# Altium schematic sheet Lipo_LiFePO4 Charger_2022-02-16.schdoc
size 795 x 256 mm
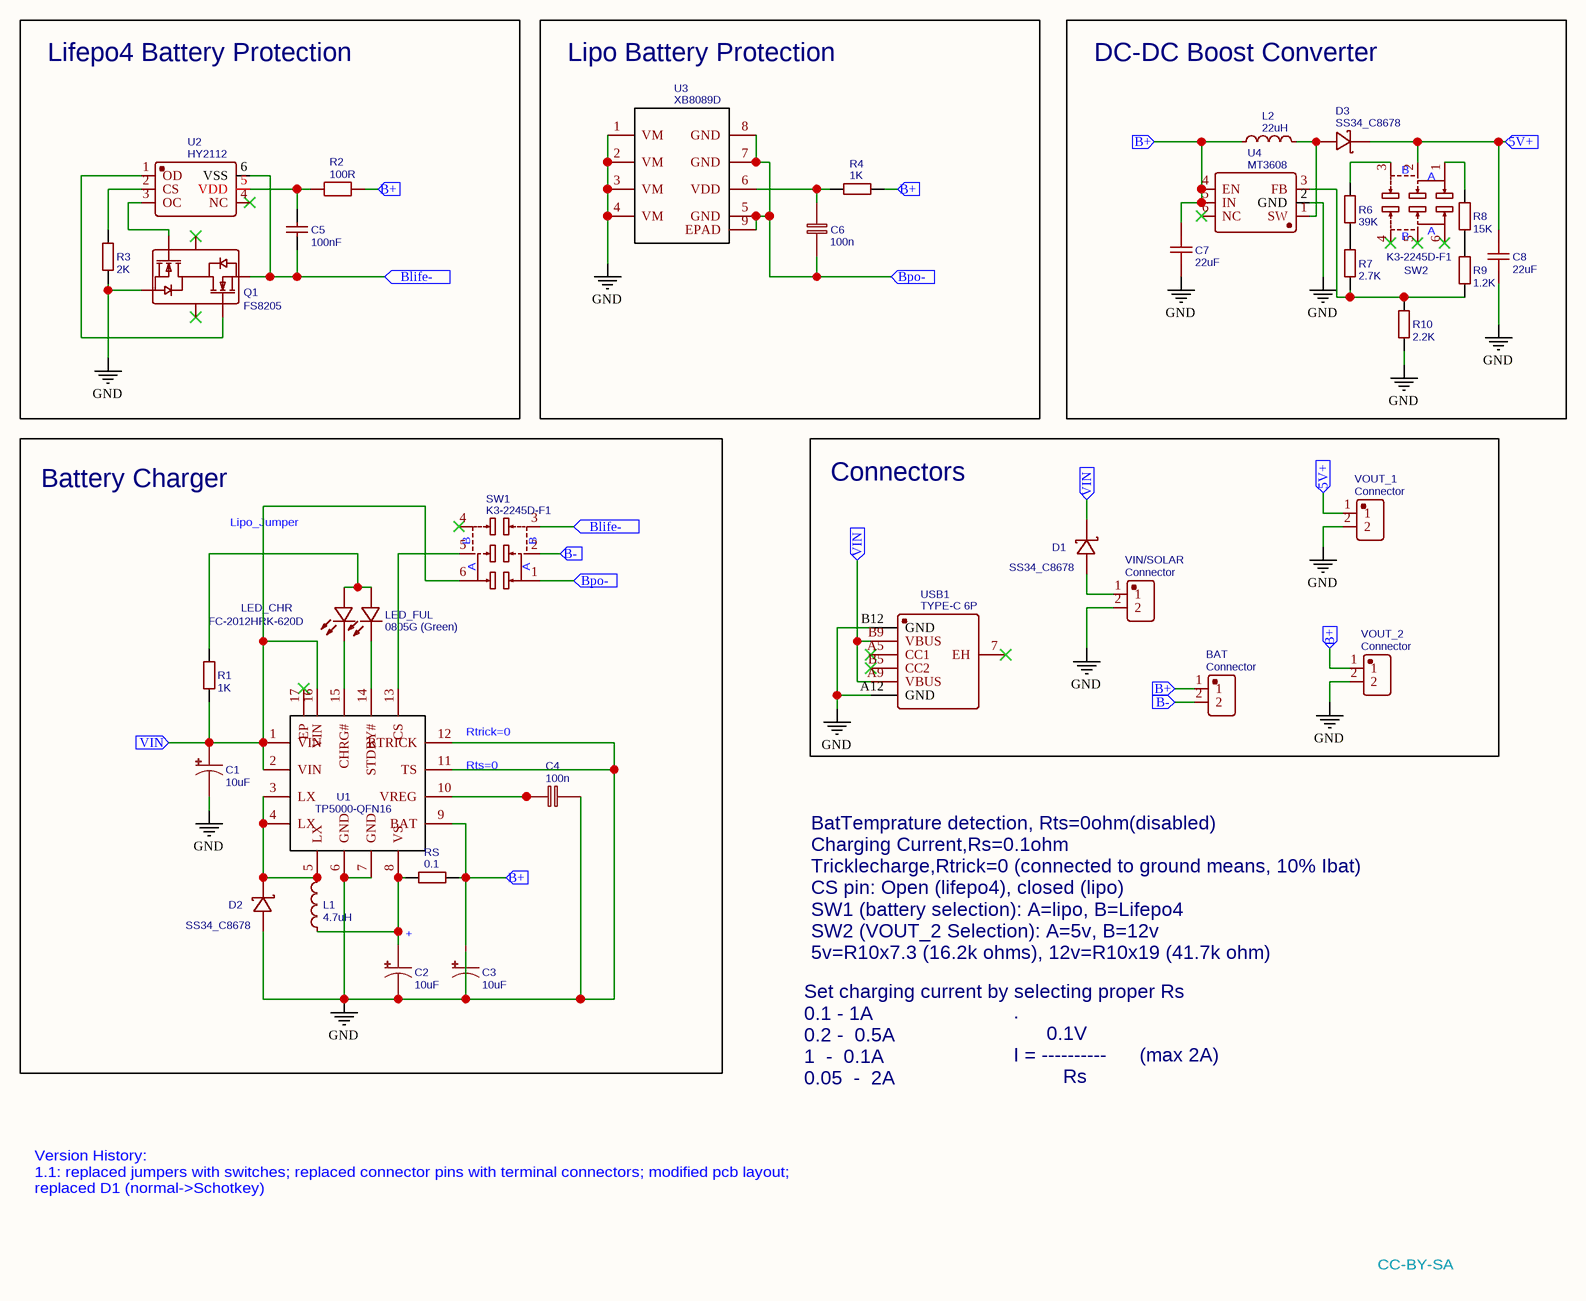
[diagram p0: Lipo_LiFePO4 Charger_2022-02-16.schdoc]

## Parts
BAT  Connector  [CONN-TH_XY308-2.54-2P]
C1  10uF  [CAP-SMD_L3.5-W2.8-R-RD]
C2  10uF  [CAP-SMD_L3.5-W2.8-R-RD]
C3  10uF  [CAP-SMD_L3.5-W2.8-R-RD]
C4  100n  [0805]
C5  100nF  [C0805]
C6  100n  [0805]
C7  22uF  [C0805]
C8  22uF  [C0805]
D1  SS34_C8678  [DO-214AC_L4.3-W2.7-LS5.3-RD]
D2  SS34_C8678  [DO-214AC_L4.3-W2.7-LS5.3-RD]
D3  SS34_C8678  [DO-214AC_L4.3-W2.7-LS5.3-RD]
L1  4.7uH  [IND-SMD_L7.1-W6.6]
L2  22uH  [IND-SMD_L7.0-W6.8]
LED_CHR  FC-2012HRK-620D  [LED0805-RD]
LED_FUL  0805G (Green)  [LED0805-RD]
Q1  FS8205  [SOT-23-6]
R1  1K  [R0805]
R2  100R  [0805]
R3  2K  [R0805]
R4  1K  [R0805]
R6  39K  [R0805]
R7  2.7K  [R0805]
R8  15K  [R0805]
R9  1.2K  [R0805]
R10  2.2K  [R0805]
RS  0.1  [R1206]
SW1  K3-2245D-F1  [SW-TH_K3-2245D-F1]
SW2  K3-2245D-F1  [SW-TH_K3-2245D-F1]
U1  TP5000-QFN16  [QFN-16_L4.0-W4.0-P0.65-BL-EP2.2]
U2  HY2112  [SOT-23-6]
U3  XB8089D  [SOIC-8_L5.0-W4.0-P1.27-LS6.0-BL-EP]
U4  MT3608  [SOT-23-6_L2.9-W1.6-P0.95-LS2.8-BR]
USB1  TYPE-C 6P  [TYPE-C-SMD_TYPE-C-6P]
VIN/SOLAR  Connector  [CONN-TH_XY308-2.54-2P]
VOUT_1  Connector  [CONN-TH_XY308-2.54-2P]
VOUT_2  Connector  [CONN-TH_XY308-2.54-2P]

## Blocks framed on the sheet
Lifepo4 Battery Protection: C5 Q1 R2 R3 U2
Lipo Battery Protection: C6 R4 U3
DC-DC Boost Converter: C7 C8 D3 L2 R6-R10 SW2 U4
Battery Charger: C1-C4 D2 L1 LED_CHR LED_FUL R1 RS SW1 U1
Connectors: BAT D1 USB1 VIN/SOLAR VOUT_1 VOUT_2

## Ports
5V+ (in), B+ (in), B- (in), Blife- (in), Bpo- (in), VIN (in)

## Nets
GND: C1.2 C2.2 C3.2 C4.2 C7.1 C8.1 D2.2(A) Q1.3(S2) R3.1 R10.1 U1.6(GND) U1.7(GND) U1.11(TS) U1.12(RTRICK) U3.1(VM) U3.2(VM) U3.3(VM) U3.4(VM) U4.2(GND) USB1.A12(GND) USB1.B12(GND) VIN/SOLAR.2 VOUT_1.2 VOUT_2.2
5V+: C8.2 D3.1(K) SW2.2 VOUT_1.1 ; port 5V+
B+: BAT.1 C3.1 C7.2 L2.1 R2.2 R4.1 RS.2 U1.9(BAT) U4.4(EN) U4.5(IN) VOUT_2.1 ; port B+
B-: BAT.2 SW1.2 ; port B-
Blife-: C5.1 Q1.1(S1) SW1.3 U2.6(VSS) ; port Blife-
Bpo-: C6.2 SW1.1 U3.5(GND) U3.7(GND) U3.8(GND) U3.9(EPAD) ; port Bpo-
VIN: C1.1 D1.1(K) R1.1 SW1.6 U1.1(VIN) U1.2(VIN) U1.16(VIN) USB1.A9(VBUS) USB1.B9(VBUS) ; port VIN
NetC2_1: C2.1 L1.1 RS.1 U1.8(VS)
NetC4_1: C4.1 U1.10(VREG)
NetC5_2: C5.2 R2.1 U2.5(VDD)
NetC6_1: C6.1 R4.2 U3.6(VDD)
NetD1_2: D1.2(A) VIN/SOLAR.1
NetD2_1: D2.1(K) L1.2 U1.3(LX) U1.4(LX) U1.5(LX)
NetD3_2: D3.2(A) L2.2 U4.1(SW)
NetLED_CHR_1: LED_CHR.1(-) U1.15(CHRG#)
NetLED_CHR_2: LED_CHR.2(+) LED_FUL.2(A) R1.2
NetLED_FUL_1: LED_FUL.1(K) U1.14(STDBY#)
NetQ1_4: Q1.4(G2) U2.3(OC)
NetQ1_6: Q1.6(G1) U2.1(OD)
NetR3_2: R3.2 U2.2(CS)
NetR6_1: R6.1 R7.2
NetR6_2: R6.2 SW2.3
NetR7_1: R7.1 R9.1 R10.2 U4.3(FB)
NetR8_1: R8.1 R9.2
NetR8_2: R8.2 SW2.1
NetSW1_5: SW1.5 U1.13(CS)

Not connected (* = marked no-connect by the designer): Q1 2(D12)* 5(D12)*; SW1 4*; SW2 4* 5* 6*; U1 17(EP)*; U2 4(NC)*; U4 6(NC)*; USB1 7(EH)* A5(CC1)* B5(CC2)*

## Notes on the sheet
- Lipo_Jumper
- Rtrick=0
- Rts=0
- BatTemprature detection, Rts=0ohm(disabled)
  Charging Current,Rs=0.1ohm
  Tricklecharge,Rtrick=0 (connected to ground means, 10% Ibat)
  CS pin: Open (lifepo4), closed (lipo)
  SW1 (battery selection): A=lipo, B=Lifepo4
  SW2 (VOUT_2 Selection): A=5v, B=12v
  5v=R10x7.3 (16.2k ohms), 12v=R10x19 (41.7k ohm)
- (near C2) +
- Set charging current by selecting proper Rs
  0.1 - 1A
  0.2 -  0.5A
  1  -  0.1A
  0.05  -  2A
- .
  0.1V
  I = ----------      (max 2A)
  Rs
- Version History:
  1.1: replaced jumpers with switches; replaced connector pins with terminal connectors; modified pcb layout;
  replaced D1 (normal->Schotkey)
- CC-BY-SA
- (in symbol K3-2245D-F1) B; A

## Library data of the parts
BAT VIN/SOLAR VOUT_1 VOUT_2 = Connector: BOM_Manufacturer Part: XY308-2.54-2P; Contributor: LCSC; SMT Type: Extend; BOM_Paste Type: expand; BOM_Supplier: LCSC; BOM_Supplier Part: C557685; BOM_Manufacturer: --; BOM_LCSC Assembly: Yes; spicePre: U; spiceSymbolName: XY308-2.54-2P
C1-C3 = 10uF: BOM_Manufacturer: VISHAY; BOM_Manufacturer Part: 293D106X9020B2TE3; nameAlias: Capacitance; Contributor: LCSC; SMT Type: Extend; BOM_Supplier: LCSC; BOM_Supplier Part: C180482; BOM_JLCPCB SMD: Yes; BOM_LCSC Assembly: Yes; spicePre: C; spiceSymbolName: 293D106X9020B2TE3
C4 C6 = 100n: BOM_Manufacturer Part: CC0805KRX7R9BB104; BOM_Manufacturer: YAGEO; nameAlias: Value(F); spicePre: C; spiceSymbolName: Cap_0603_EU; BOM_Supplier: LCSC; BOM_Supplier Part: C49678
C5 = 100nF: BOM_Manufacturer Part: CC0805KRX7R9BB104; BOM_Manufacturer: YAGEO; nameAlias: Capacitance; SMT Type: Basic; BOM_Paste Type: base; BOM_Supplier: LCSC; BOM_Supplier Part: C49678; BOM_JLCPCB SMD: Yes; BOM_LCSC Assembly: Yes; spicePre: C; spiceSymbolName: CC0805KRX7R9BB104
C7 C8 = 22uF: BOM_Manufacturer: SAMSUNG; BOM_Manufacturer Part: CL21A226MAQNNNE; nameAlias: Capacitance; SMT Type: Basic; BOM_Paste Type: base; BOM_Supplier: LCSC; BOM_Supplier Part: C45783; BOM_JLCPCB SMD: Yes; BOM_LCSC Assembly: Yes; spicePre: C; spiceSymbolName: CL21A226MAQNNNE
D1-D3 = SS34_C8678: BOM_Manufacturer Part: SS34; BOM_Manufacturer: MDD; SMT Type: Basic; BOM_Supplier: LCSC; image: //image.lceda.cn/szlcsc/C8678.jpg; BOM_Supplier Part: C8678; BOM_JLCPCB SMD: Yes; spicePre: D; spiceSymbolName: SS34_C8678
L1 = 4.7uH: BOM_Manufacturer: SXN; BOM_Manufacturer Part: SMMS0650-4R7M; nameAlias: Inductance; SMT Type: Extend; BOM_Supplier: LCSC; BOM_Supplier Part: C149582; BOM_JLCPCB SMD: Yes; spicePre: L; spiceSymbolName: SMMS0650-4R7M
L2 = 22uH: BOM_Manufacturer: SXN; BOM_Manufacturer Part: SMRH74-220MT; nameAlias: Inductance; BOM_Supplier: LCSC; BOM_Supplier Part: C27442; BOM_JLCPCB Part Class: Extended Part; spicePre: L; spiceSymbolName: SMRH74-220MT
LED_CHR = FC-2012HRK-620D: BOM_Manufacturer: NATIONSTAR; SMT Type: Basic; BOM_Supplier: LCSC; BOM_Manufacturer Part: FC-2012HRK-620D; image: //image.lceda.cn/szlcsc/C84256.jpg; BOM_Supplier Part: C84256; BOM_JLCPCB SMD: Yes; spicePre: L; spiceSymbolName: FC-2012HRK-620D
LED_FUL = 0805G (Green): BOM_Manufacturer: KENTO; SMT Type: Basic; BOM_Supplier: LCSC; BOM_Manufacturer Part: 0805G (Green); image: //image.lceda.cn/szlcsc/C2297.jpg; BOM_Supplier Part: C2297; BOM_JLCPCB SMD: Yes; spicePre: L; spiceSymbolName: 0805G (Green)
Q1 = FS8205: BOM_Manufacturer: FORTUNE; BOM_Supplier: LCSC; BOM_Manufacturer Part: FS8205; BOM_LCSC Assembly: Yes; image: //image.lceda.cn/szlcsc/C32254.jpg; BOM_Supplier Part: C32254; spicePre: Q
R1 R4 = 1K: BOM_Manufacturer: UniOhm; BOM_Manufacturer Part: 0805W8F1001T5E; nameAlias: Resistance (Ohms); SMT Type: Basic; BOM_Supplier: LCSC; BOM_Supplier Part: C17513; BOM_JLCPCB SMD: Yes; spicePre: R; spiceSymbolName: 0805W8F1001T5E
R2 = 100R: BOM_Manufacturer Part: 0805W8F1000T5E; BOM_Manufacturer: UniOhm; nameAlias: Value(Ω); spicePre: R; spiceSymbolName: Res_0603(1/10W)_EU; BOM_Supplier: LCSC; BOM_Supplier Part: C17408
R3 = 2K: BOM_Manufacturer: UniOhm; BOM_Manufacturer Part: 0805W8F2001T5E; nameAlias: Resistance (Ohms); SMT Type: Basic; BOM_Paste Type: base; BOM_Supplier: LCSC; BOM_Supplier Part: C17604; BOM_JLCPCB SMD: Yes; BOM_LCSC Assembly: Yes; spicePre: R; spiceSymbolName: 0805W8F2001T5E
R6 = 39K: BOM_Manufacturer: UniOhm; BOM_Manufacturer Part: 0805W8F3902T5E; nameAlias: Resistance (Ohms); SMT Type: Basic; BOM_Paste Type: base; BOM_Supplier: LCSC; BOM_Supplier Part: C25826; BOM_JLCPCB SMD: Yes; BOM_LCSC Assembly: Yes; spicePre: R; spiceSymbolName: 0805W8F3902T5E
R7 = 2.7K: BOM_Manufacturer: UniOhm; BOM_Manufacturer Part: 0805W8F2701T5E; nameAlias: Resistance (Ohms); SMT Type: Basic; BOM_Paste Type: base; BOM_Supplier: LCSC; BOM_Supplier Part: C17530; BOM_JLCPCB SMD: Yes; BOM_LCSC Assembly: Yes; spicePre: R; spiceSymbolName: 0805W8F2701T5E
R8 = 15K: BOM_Manufacturer: UniOhm; BOM_Manufacturer Part: 0805W8F1502T5E; nameAlias: Resistance (Ohms); SMT Type: Basic; BOM_Paste Type: base; BOM_Supplier: LCSC; BOM_Supplier Part: C17475; BOM_JLCPCB SMD: Yes; BOM_LCSC Assembly: Yes; spicePre: R; spiceSymbolName: 0805W8F1502T5E
R9 = 1.2K: BOM_Manufacturer: UniOhm; BOM_Manufacturer Part: 0805W8F1201T5E; nameAlias: Resistance (Ohms); SMT Type: Basic; BOM_Paste Type: base; BOM_Supplier: LCSC; BOM_Supplier Part: C17379; BOM_JLCPCB SMD: Yes; BOM_LCSC Assembly: Yes; spicePre: R; spiceSymbolName: 0805W8F1201T5E
R10 = 2.2K: BOM_Manufacturer: UniOhm; BOM_Manufacturer Part: 0805W8F2201T5E; nameAlias: Resistance (Ohms); SMT Type: Basic; BOM_Paste Type: base; BOM_Supplier: LCSC; BOM_Supplier Part: C17520; BOM_JLCPCB SMD: Yes; BOM_LCSC Assembly: Yes; spicePre: R; spiceSymbolName: 0805W8F2201T5E
RS = 0.1: BOM_Manufacturer: UniOhm; BOM_Manufacturer Part: 1206W4F100LT5E; nameAlias: Resistance (Ohms); SMT Type: Basic; BOM_Supplier: LCSC; BOM_Supplier Part: C25334; BOM_JLCPCB SMD: Yes; spicePre: R; spiceSymbolName: 1206W4F100LT5E
SW1 SW2 = K3-2245D-F1: BOM_Manufacturer: Korean Hroparts Elec; Contributor: LCSC; SMT Type: Extend; BOM_Paste Type: expand; BOM_Supplier: LCSC; BOM_Supplier Part: C223863; BOM_Manufacturer Part: K3-2245D-F1; BOM_LCSC Assembly: Yes; spicePre: S; spiceSymbolName: K3-2245D-F1
U1 = TP5000-QFN16: BOM_Manufacturer: TOPPOWER; SMT Type: Extend; BOM_Supplier: LCSC; BOM_Manufacturer Part: TP5000-QFN16; image: //image.lceda.cn/szlcsc/C51699.jpg; BOM_Supplier Part: C51699; BOM_JLCPCB SMD: Yes; spicePre: U; spiceSymbolName: TP5000-QFN16
U2 = HY2112: BOM_Manufacturer: HYCON; Contributor: LCSC; SMT Type: Extend; BOM_Supplier: LCSC; BOM_Manufacturer Part: HY2112; BOM_Supplier Part: C161942; BOM_LCSC Assembly: Yes; spicePre: U
U3 = XB8089D: BOM_Manufacturer: Xysemi; SMT Type: Extend; BOM_Paste Type: expand; BOM_Supplier: LCSC; BOM_Manufacturer Part: XB8089D; image: //image.lceda.cn/szlcsc/C79928.jpg; BOM_Supplier Part: C79928; BOM_JLCPCB SMD: Yes; BOM_LCSC Assembly: Yes; spicePre: U; spiceSymbolName: XB8089D
U4 = MT3608: BOM_Manufacturer: AEROSEMI; SMT Type: Extend; BOM_Paste Type: recommend; BOM_Supplier: LCSC; BOM_Manufacturer Part: MT3608; BOM_Supplier Part: C84817; BOM_JLCPCB SMD: Yes; spicePre: U; spiceSymbolName: MT3608
USB1 = TYPE-C 6P: BOM_Manufacturer: SHOU HAN; Contributor: LCSC; BOM_Supplier: LCSC; BOM_Supplier Part: C456012; BOM_Manufacturer Part: TYPE-C 6P; spicePre: U; spiceSymbolName: TYPE-C 6P